# EAGLE design pattern-test-board (EAGLE 9.6.2)
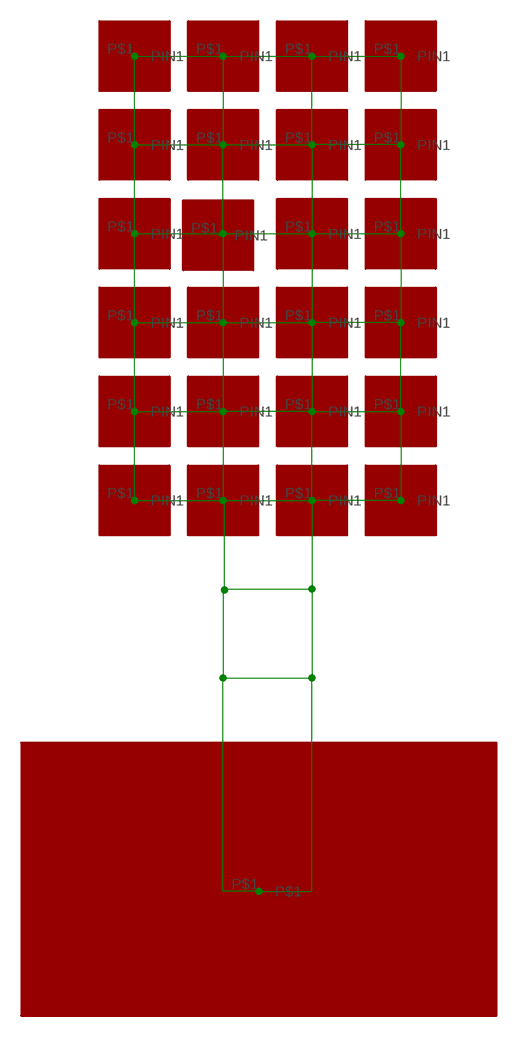
[diagram p0: schematic, sheet 1]

## Parts
U$1  TOUCHPIN  [TOUCHPOINT]
U$2  TOUCHPIN  [TOUCHPOINT]
U$3  TOUCHPIN  [TOUCHPOINT]
U$4  TOUCHPIN  [TOUCHPOINT]
U$5  TOUCHPIN  [TOUCHPOINT]
U$6  TOUCHPIN  [TOUCHPOINT]
U$7  TOUCHPIN  [TOUCHPOINT]
U$8  TOUCHPIN  [TOUCHPOINT]
U$9  TOUCHPIN  [TOUCHPOINT]
U$14  TOUCHPIN  [TOUCHPOINT]
U$15  TOUCHPIN  [TOUCHPOINT]
U$16  TOUCHPIN  [TOUCHPOINT]
U$17  TOUCHPIN  [TOUCHPOINT]
U$18  TOUCHPIN  [TOUCHPOINT]
U$19  TOUCHPIN  [TOUCHPOINT]
U$20  TOUCHPIN  [TOUCHPOINT]
U$21  TOUCHPIN  [TOUCHPOINT]
U$22  TOUCHPIN  [TOUCHPOINT]
U$23  TOUCHPIN  [TOUCHPOINT]
U$28  TOUCHPIN  [TOUCHPOINT]
U$29  TOUCHPIN  [TOUCHPOINT]
U$30  TOUCHPIN  [TOUCHPOINT]
U$31  TOUCHPIN  [TOUCHPOINT]
U$32  TOUCHPIN  [TOUCHPOINT]
U$33  TOUCHBASE  [TOUCHBASE]

## Nets
GND: U$1.P$1(PIN1) U$2.P$1(PIN1) U$3.P$1(PIN1) U$4.P$1(PIN1) U$5.P$1(PIN1) U$6.P$1(PIN1) U$7.P$1(PIN1) U$8.P$1(PIN1) U$9.P$1(PIN1) U$14.P$1(PIN1) U$15.P$1(PIN1) U$16.P$1(PIN1) U$17.P$1(PIN1) U$18.P$1(PIN1) U$19.P$1(PIN1) U$20.P$1(PIN1) U$21.P$1(PIN1) U$22.P$1(PIN1) U$23.P$1(PIN1) U$28.P$1(PIN1) U$29.P$1(PIN1) U$30.P$1(PIN1) U$31.P$1(PIN1) U$32.P$1(PIN1) U$33.P$1

## Library data of the parts
U$1-U$9 U$14-U$23 U$28-U$32 = touch-point:TOUCHPIN
U$33 = touch-point:TOUCHBASE

## Board
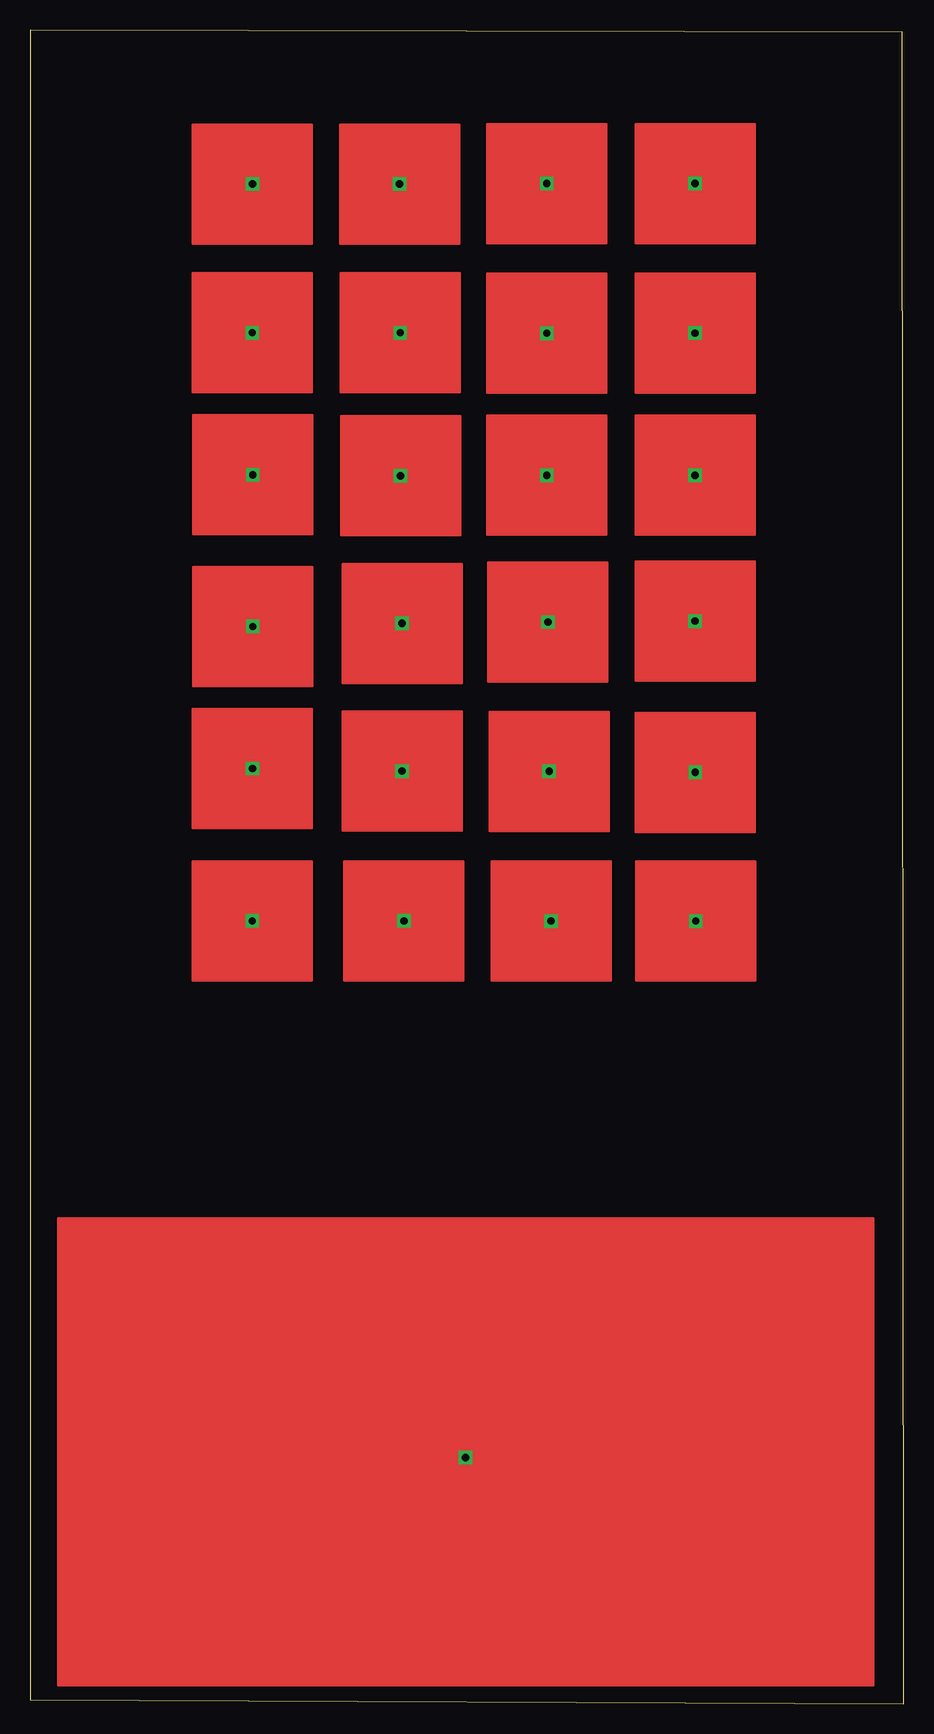
[diagram p1: board, top side]
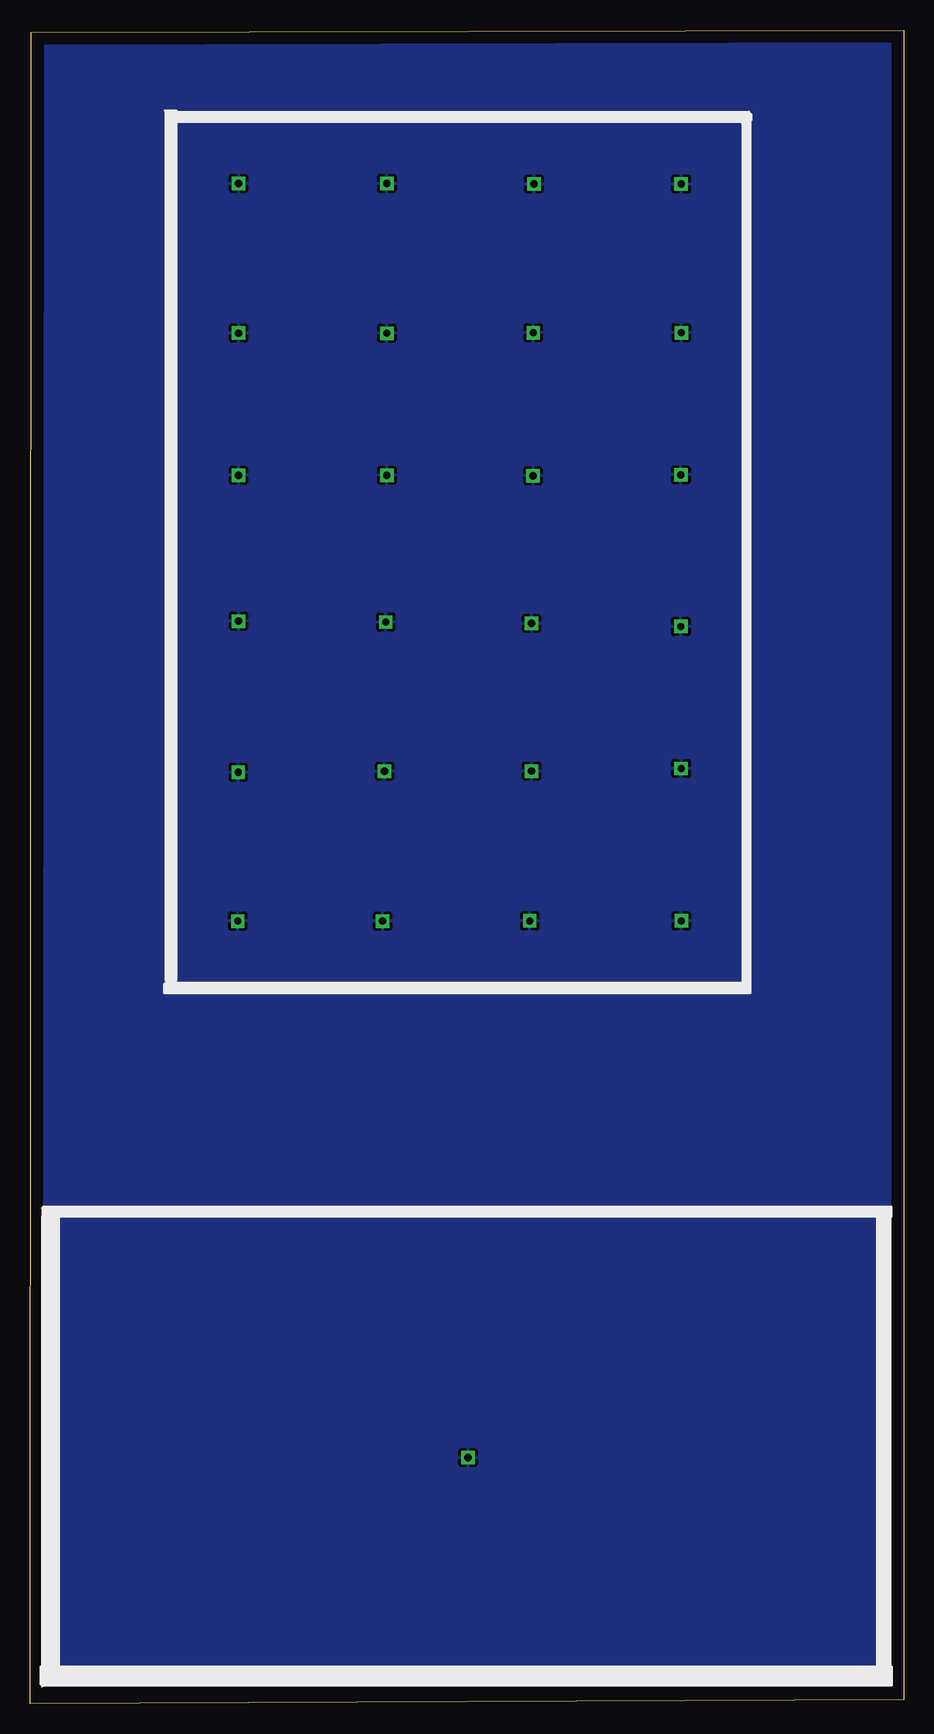
[diagram p2: board, bottom side, seen from below]

Size 72.8 x 139.5 mm. Coordinates in mm from the lower left corner, seen from the top.
Outline: 0,0.3 72.8,0 72.7,139.3 0,139.5 0,0.3
Copper layers (1*16): Top 0.035mm / dielectric 1.5mm / Bottom 0.035mm
Design rules "default": minimum track width 6mil, minimum drill 0.35mm, track to track 6mil, track to pad 6mil, pad to pad 6mil, via to via 6mil, smd to smd 6mil, copper to edge 40mil, drill to drill 6mil, minimum pad ring 10mil, minimum via ring 8mil, stop-mask expansion 4mil, vias tented up to drill 0mil, thermal gap 10mil

### Footprints (pad centres in the part's own frame; a part is rotated, then mirrored left to right if it is on the bottom)
TOUCHPOINT = drill 0.6 square: P$1 0,0
TOUCHBASE = drill 0.6 square: P$1 0,19

### Placement (x,y rotation side)
U$1  55.42,90.22 0 top
U$2  43.06,114.22 0 top
U$3  31,77.72 0 top
U$4  55.44,77.62 0 top
U$5  55.48,65.22 0 top
U$6  43.42,65.22 0 top
U$7  18.56,102.42 0 top
U$8  55.42,102.38 0 top
U$9  43.06,102.38 0 top
U$14  18.56,89.78 0 top
U$15  55.42,114.24 0 top
U$16  43.16,90.14 0 top
U$17  31,90.04 0 top
U$18  18.54,77.94 0 top
U$19  30.88,102.34 0 top
U$20  18.52,65.24 0 top
U$21  31.16,65.24 0 top
U$22  55.42,126.7 0 top
U$23  43.06,126.7 0 top
U$28  43.26,77.7 0 top
U$29  18.52,114.26 0 top
U$30  30.86,114.26 0 top
U$31  30.8,126.66 0 top
U$32  18.54,126.66 0 top
U$33  36.3,1.5 0 top

### Tracks (layer width: path | path; a pad name or v marks a point on that pad's centre or on a via)
GND
  pour Bottom: 1,1.5 1,138.5 72,138.5 72,1.5